# EAGLE schematic glowna (EAGLE 7.2.0)
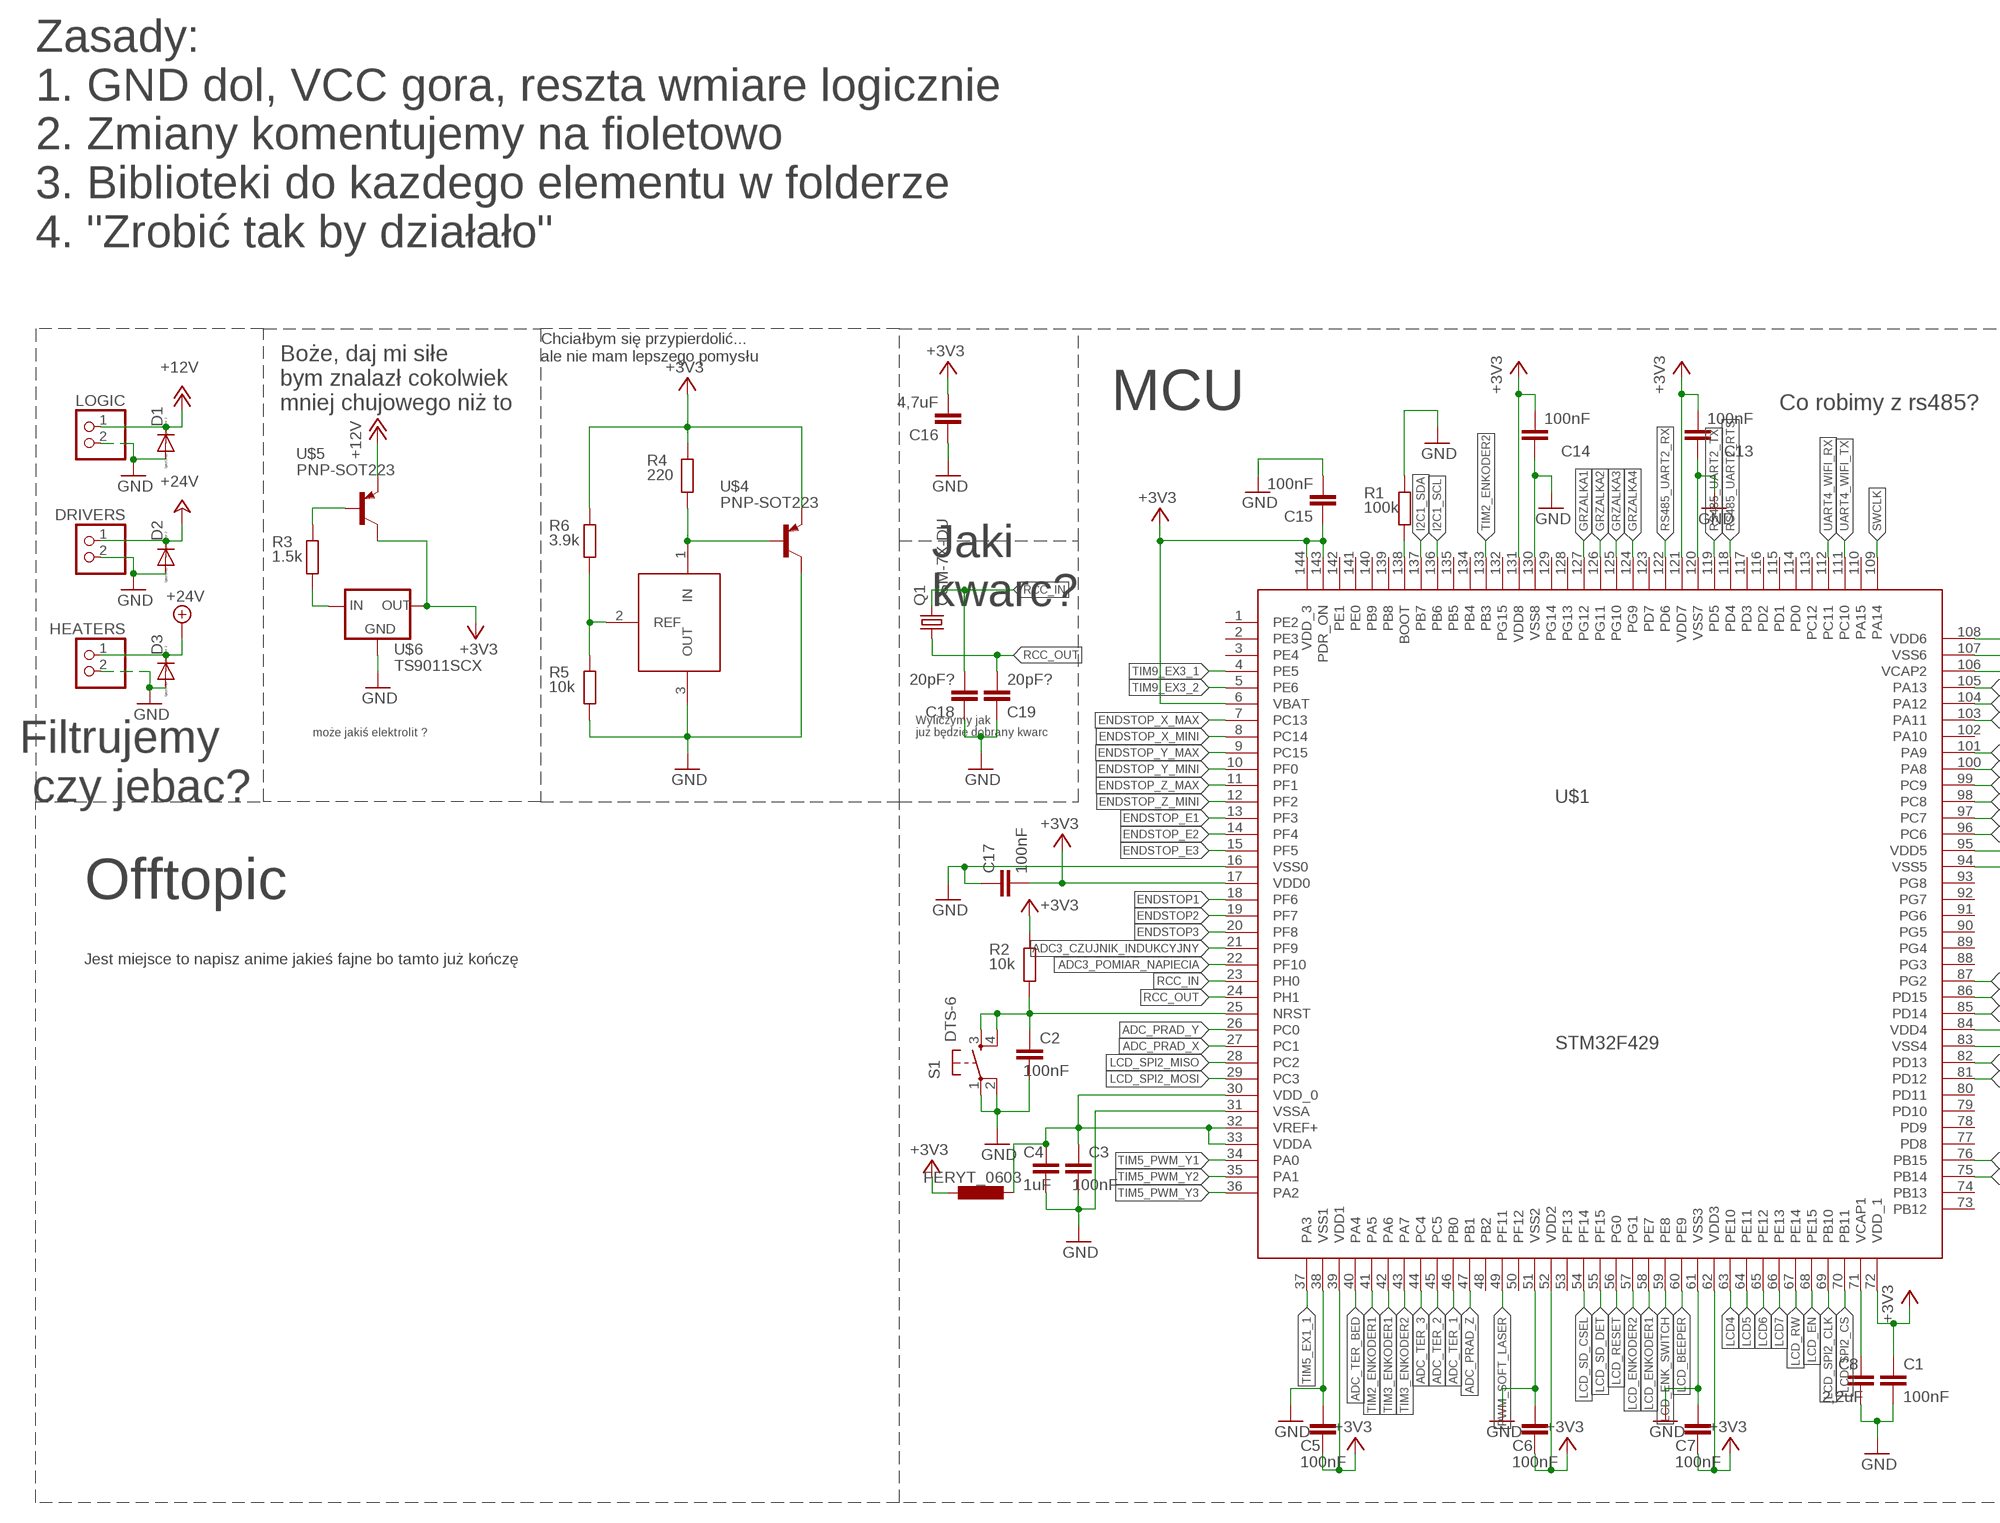
[diagram p0: schematic, sheet 1, part 1 of 2]
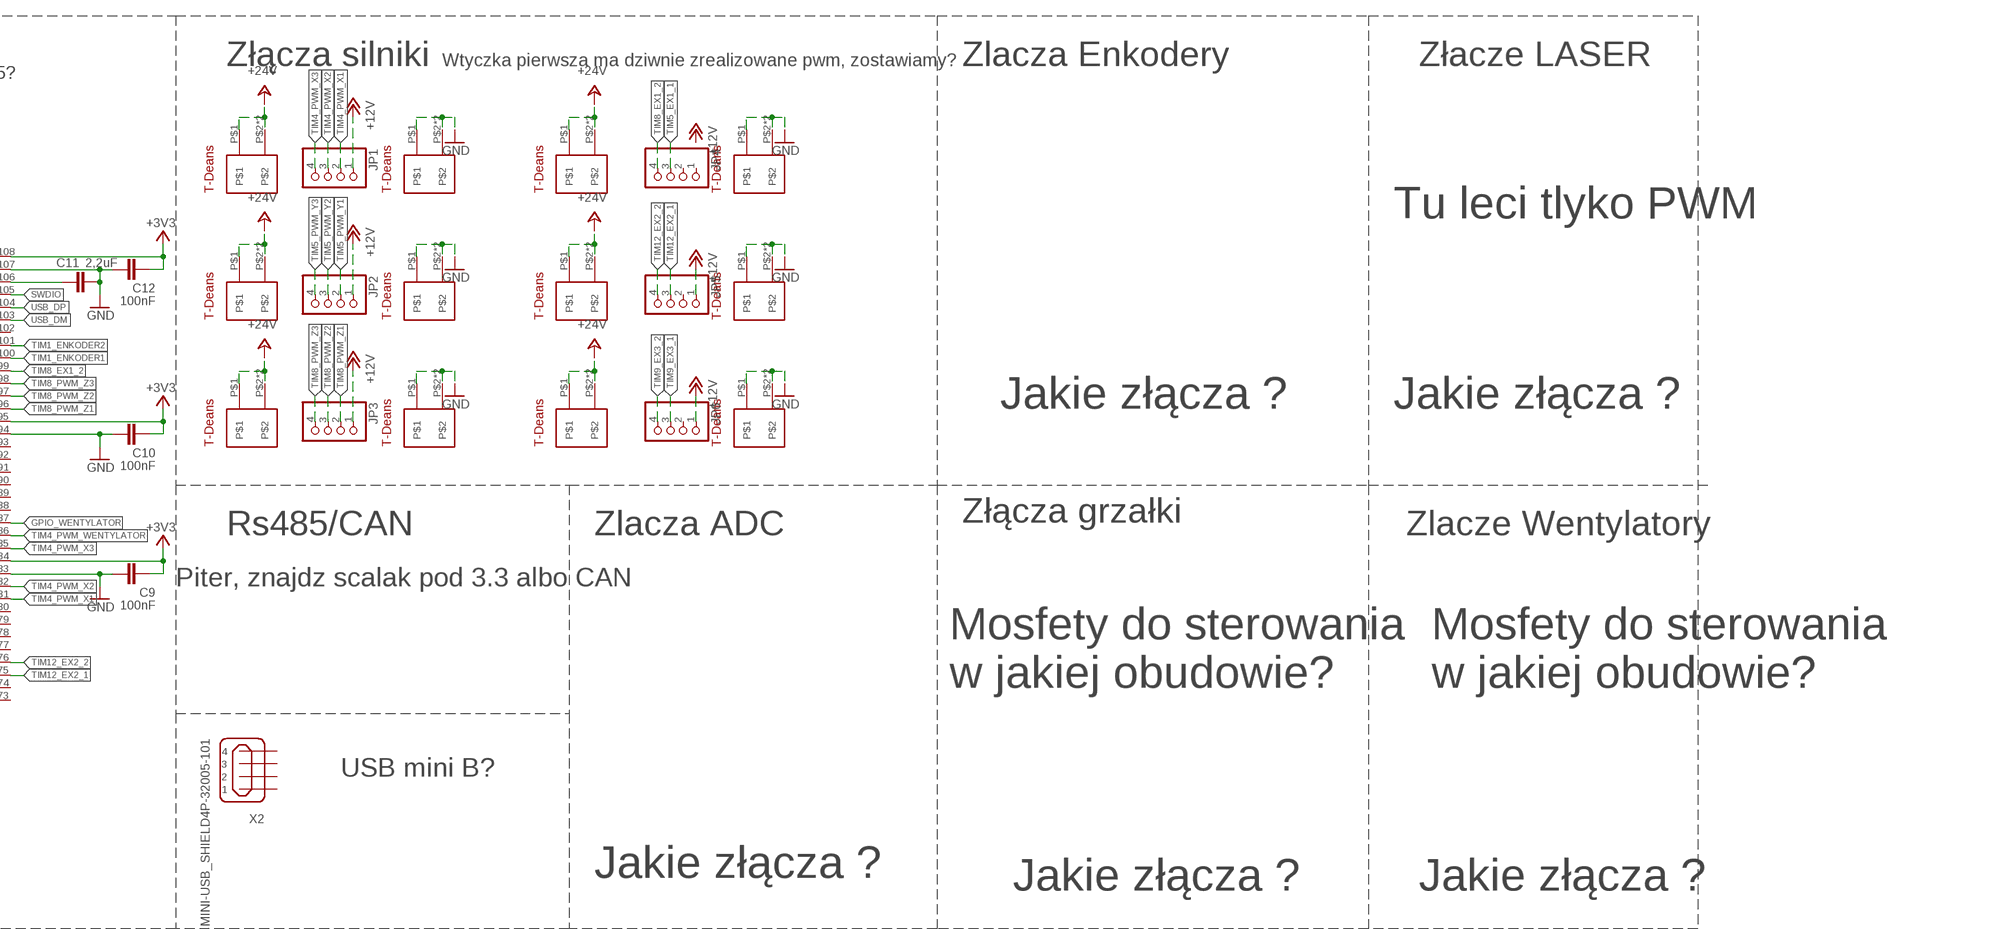
[diagram p1: schematic, sheet 1, part 2 of 2]

## Parts
C1  100nF  C-EUC0603  [C0603]
C2  100nF  C-EUC0603  [C0603]
C3  100nF  C-EUC0603  [C0603]
C4  1uF  C-EUC0603  [C0603]
C5  100nF  C-EUC0603  [C0603]
C6  100nF  C-EUC0603  [C0603]
C7  100nF  C-EUC0603  [C0603]
C8  2,2uF  C-EUC0603  [C0603]
C9  100nF  C-EUC0603  [C0603]
C10  100nF  C-EUC0603  [C0603]
C11  2,2uF  C-EUC0603  [C0603]
C12  100nF  C-EUC0603  [C0603]
C13  100nF  C-EUC0603  [C0603]
C14  100nF  C-EUC0603  [C0603]
C15  100nF  C-EUC0603  [C0603]
C16  4,7uF  C-EUC0603  [C0603]
C17  100nF  C-EUC0603  [C0603]
C18  20pF?  C-EUC0603  [C0603]
C19  20pF?  C-EUC0603  [C0603]
D1  DIODE-DO-214AC  [DO-214AC]
D2  DIODE-DO-214AC  [DO-214AC]
D3  DIODE-DO-214AC  [DO-214AC]
DRIVERS  PINHD-1X2  [1X02]
HEATERS  PINHD-1X2  [1X02]
JP1  PINHD-1X4  [1X04]
JP2  PINHD-1X4  [1X04]
JP3  PINHD-1X4  [1X04]
JP4  PINHD-1X4  [1X04]
JP5  PINHD-1X4  [1X04]
JP6  PINHD-1X4  [1X04]
LOGIC  PINHD-1X2  [1X02]
Q1  CSM-7X-DU  [CSM-7X-DU]
R1  100k  R-EU_R0603  [R0603]
R2  10k  R-EU_R0603  [R0603]
R3  1.5k  R-EU_R0603  [R0603]
R4  220  R-EU_R0603  [R0603]
R5  10k  R-EU_R0603  [R0603]
R6  3.9k  R-EU_R0603  [R0603]
S1  DTS-6  [DTS-6]
U$1  STM32F429  [SQFP-S-20X20-144]
U$2  FERYT_0603  [R0603]
U$3  TL431AIDBZR  [SOT23]
U$4  PNP-SOT223  [SOT223]
U$5  PNP-SOT223  [SOT223]
U$6  TS9011SCX  [SOT23]
U$7  T-DEANS  [T-DEANS]
U$8  T-DEANS  [T-DEANS]
U$9  T-DEANS  [T-DEANS]
U$10  T-DEANS  [T-DEANS]
U$11  T-DEANS  [T-DEANS]
U$12  T-DEANS  [T-DEANS]
U$13  T-DEANS  [T-DEANS]
U$14  T-DEANS  [T-DEANS]
U$15  T-DEANS  [T-DEANS]
U$16  T-DEANS  [T-DEANS]
U$17  T-DEANS  [T-DEANS]
U$18  T-DEANS  [T-DEANS]
X2  MINI-USB_SHIELD4P-32005-101  [32005-101]

## Nets
+3V3: C1.1 C5.2 C6.2 C7.2 C9.2 C10.2 C12.2 C13.2 C14.2 C15.1 C16.2 C17.2 R2.1 R4.1 R6.1 U$1.6(VBAT) U$1.17(VDD0) U$1.39(VDD1) U$1.52(VDD2) U$1.62(VDD3) U$1.72(VDD_1) U$1.84(VDD4) U$1.95(VDD5) U$1.108(VDD6) U$1.121(VDD7) U$1.131(VDD8) U$1.143(PDR_ON) U$1.144(VDD_3) U$2.1 U$4.3(E) U$5.2(C) U$5.4(C) U$6.2(OUT)
+12V: D1.C JP1.1 JP2.1 JP3.1 JP5.1 JP6.1 LOGIC.1 U$5.3(E)
+24V: D2.C D3.C DRIVERS.1 HEATERS.1 U$7.P$1 U$7.P$2 U$7.P$3 U$9.P$1 U$9.P$2 U$9.P$3 U$11.P$1 U$11.P$2 U$11.P$3 U$13.P$1 U$13.P$2 U$13.P$3 U$15.P$1 U$15.P$2 U$15.P$3 U$17.P$1 U$17.P$2 U$17.P$3
ADC3_CZUJNIK_INDUKCYJNY: U$1.21(PF9)
ADC3_POMIAR_NAPIECIA: U$1.22(PF10)
ADC_PRAD_X: U$1.27(PC1)
ADC_PRAD_Y: U$1.26(PC0)
ADC_PRAD_Z: U$1.47(PB1)
ADC_TER_1: U$1.46(PB0)
ADC_TER_2: U$1.45(PC5)
ADC_TER_3: U$1.44(PC4)
ADC_TER_BED: U$1.40(PA4)
ENDSTOP1: U$1.18(PF6)
ENDSTOP2: U$1.19(PF7)
ENDSTOP3: U$1.20(PF8)
ENDSTOP_E1: U$1.13(PF3)
ENDSTOP_E2: U$1.14(PF4)
ENDSTOP_E3: U$1.15(PF5)
ENDSTOP_X_MAX: U$1.7(PC13)
ENDSTOP_X_MINI: U$1.8(PC14)
ENDSTOP_Y_MAX: U$1.9(PC15)
ENDSTOP_Y_MINI: U$1.10(PF0)
ENDSTOP_Z_MAX: U$1.11(PF1)
ENDSTOP_Z_MINI: U$1.12(PF2)
GND: C1.2 C2.2 C3.2 C4.2 C5.1 C6.1 C7.1 C8.2 C9.1 C10.1 C11.2 C12.1 C13.1 C14.1 C15.2 C16.1 C17.1 C18.1 C19.1 D1.A D2.A D3.A DRIVERS.2 HEATERS.2 LOGIC.2 R1.1 R5.2 S1.1 S1.2 U$1.16(VSS0) U$1.31(VSSA) U$1.38(VSS1) U$1.51(VSS2) U$1.61(VSS3) U$1.83(VSS4) U$1.94(VSS5) U$1.107(VSS6) U$1.120(VSS7) U$1.130(VSS8) U$3.3(OUT) U$4.2(C) U$4.4(C) U$6.1(GND) U$8.P$1 U$8.P$2 U$8.P$3 U$10.P$1 U$10.P$2 U$10.P$3 U$12.P$1 U$12.P$2 U$12.P$3 U$14.P$1 U$14.P$2 U$14.P$3 U$16.P$1 U$16.P$2 U$16.P$3 U$18.P$1 U$18.P$2 U$18.P$3
GPIO_WENTYLATOR: U$1.87(PG2)
GRZALKA1: U$1.127(PG12)
GRZALKA2: U$1.126(PG11)
GRZALKA3: U$1.125(PG10)
GRZALKA4: U$1.124(PG9)
I2C1_SCL: U$1.136(PB6)
I2C1_SDA: U$1.137(PB7)
LCD4: U$1.63(PE10)
LCD5: U$1.64(PE11)
LCD6: U$1.65(PE12)
LCD7: U$1.66(PE13)
LCD_BEEPER: U$1.60(PE9)
LCD_EN: U$1.68(PE15)
LCD_ENK_SWITCH: U$1.59(PE8)
LCD_ENKODER1: U$1.58(PE7)
LCD_ENKODER2: U$1.57(PG1)
LCD_RESET: U$1.56(PG0)
LCD_RW: U$1.67(PE14)
LCD_SD_CSEL: U$1.54(PF14)
LCD_SD_DET: U$1.55(PF15)
LCD_SPI2_CLK: U$1.69(PB10)
LCD_SPI2_CS: U$1.70(PB11)
LCD_SPI2_MISO: U$1.28(PC2)
LCD_SPI2_MOSI: U$1.29(PC3)
N$1: R3.1 U$5.1(B)
N$2: C8.1 U$1.71(VCAP1)
N$3: C2.1 R2.2 S1.3 S1.4 U$1.25(NRST)
N$4: R3.2 U$6.3(IN)
N$5: C3.1 C4.1 U$1.30(VDD_0) U$1.32(VREF+) U$1.33(VDDA) U$2.2
N$6: R5.1 R6.2 U$3.2(REF)
N$9: R4.2 U$3.1(IN) U$4.1(B)
N$19: C11.1 U$1.106(VCAP2)
N$26: R1.2 U$1.138(BOOT)
PWM_SOFT_LASER: U$1.49(PF11)
RCC_IN: C18.2 Q1.2 U$1.23(PH0)
RCC_OUT: C19.2 Q1.1 U$1.24(PH1)
RS485_UART2_RTS: U$1.118(PD4)
RS485_UART2_RX: U$1.122(PD6)
RS485_UART2_TX: U$1.119(PD5)
SWCLK: U$1.109(PA14)
SWDIO: U$1.105(PA13)
TIM1_ENKODER1: U$1.100(PA8)
TIM1_ENKODER2: U$1.101(PA9)
TIM2_ENKODER1: U$1.41(PA5)
TIM2_ENKODER2: U$1.133(PB3)
TIM3_ENKODER1: U$1.42(PA6)
TIM3_ENKODER2: U$1.43(PA7)
TIM4_PWM_WENTYLATOR: U$1.86(PD15)
TIM4_PWM_X1: JP1.2 U$1.81(PD12)
TIM4_PWM_X2: JP1.3 U$1.82(PD13)
TIM4_PWM_X3: JP1.4 U$1.85(PD14)
TIM5_EX1_1: JP4.3 U$1.37(PA3)
TIM5_PWM_Y1: JP2.2 U$1.34(PA0)
TIM5_PWM_Y2: JP2.3 U$1.35(PA1)
TIM5_PWM_Y3: JP2.4 U$1.36(PA2)
TIM8_EX1_2: JP4.4 U$1.99(PC9)
TIM8_PWM_Z1: JP3.2 U$1.96(PC6)
TIM8_PWM_Z2: JP3.3 U$1.97(PC7)
TIM8_PWM_Z3: JP3.4 U$1.98(PC8)
TIM9_EX3_1: JP6.3 U$1.4(PE5)
TIM9_EX3_2: JP6.4 U$1.5(PE6)
TIM12_EX2_1: JP5.3 U$1.75(PB14)
TIM12_EX2_2: JP5.4 U$1.76(PB15)
UART4_WIFI_RX: U$1.112(PC11)
UART4_WIFI_TX: U$1.111(PC10)
USB_DM: U$1.103(PA11)
USB_DP: U$1.104(PA12)
Unconnected: JP4.1 JP4.2 JP5.2 JP6.2 U$1.1(PE2) U$1.2(PE3) U$1.3(PE4) U$1.48(PB2) U$1.50(PF12) U$1.53(PF13) U$1.73(PB12) U$1.74(PB13) U$1.77(PD8) U$1.78(PD9) U$1.79(PD10) U$1.80(PD11) U$1.88(PG3) U$1.89(PG4) U$1.90(PG5) U$1.91(PG6) U$1.92(PG7) U$1.93(PG8) U$1.102(PA10) U$1.110(PA15) U$1.113(PC12) U$1.114(PD0) U$1.115(PD1) U$1.116(PD2) U$1.117(PD3) U$1.123(PD7) U$1.128(PG13) U$1.129(PG14) U$1.132(PG15) U$1.134(PB4) U$1.135(PB5) U$1.139(PB8) U$1.140(PB9) U$1.141(PE0) U$1.142(PE1) X2.1 X2.2 X2.3 X2.4 X2.M1(S1) X2.M2(S2)

## Notes on the sheet
- Zasady:
  1. GND dol, VCC gora, reszta wmiare logicznie
  2. Zmiany komentujemy na fioletowo
  3. Biblioteki do kazdego elementu w folderze
  4. "Zrobić tak by działało"
- Chciałbym się przypierdolić...
  ale nie mam lepszego pomysłu
- Złącza silniki | Wtyczka pierwsza ma dziwnie zrealizowane pwm, zostawiamy? | Zlacza Enkodery | Złacze LASER
- Boże, daj mi siłe
  bym znalazł cokolwiek
  mniej chujowego niż to
- MCU | Co robimy z rs485?
- Tu leci tlyko PWM
- Jaki
  kwarc?
- może jakiś elektrolit ?
- Wyliczymy jak 
  już będzie dobrany kwarc
- Filtrujemy
   czy jebac?
- Jakie złącza ? | Jakie złącza ?
- Offtopic
- Jest miejsce to napisz anime jakieś fajne bo tamto już kończę
- Złącza grzałki
- Rs485/CAN | Zlacza ADC | Zlacze Wentylatory
- Piter, znajdz scalak pod 3.3 albo CAN
- Mosfety do sterowania 
  w jakiej obudowie?
- Mosfety do sterowania 
  w jakiej obudowie?
- USB mini B?
- Jakie złącza ? | Jakie złącza ? | Jakie złącza ?

## Library data of the parts
C1-C19 = rcl:C-EU: CAPACITOR, European symbol
D1-D3 = diode:DIODE-: DIODE
DRIVERS HEATERS LOGIC = pinhead:PINHD-1X2: PIN HEADER
JP1-JP6 = pinhead:PINHD-1X4: PIN HEADER
Q1 = crystal:CSM-7X-DU: SMD CRYSTAL Source: www.ecsxtal.com .. Crystal 3.6864MHz CSM_7X_DU.PDF; OC_FARNELL: unknown; OC_NEWARK: unknown
R1-R6 = rcl:R-EU_: RESISTOR, European symbol
S1 = switch-tact:DTS-6
U$1 = Stm32_144pin:STM32F429
U$2 = rcl:FERYT_0603
U$3 = robione:TL431AIDBZR
U$4 U$5 = robione:PNP
U$6 = v-reg:TS9011SCX
U$7-U$18 = Conector_T-deans:T-DEANS
X2 = con-cypressindustries:MINI-USB_SHIELD4P-: MINI USB 4 Pol. Source: www.cypressindustries.com; OC_FARNELL: unknown; OC_NEWARK: unknown